# Altium schematic sheet AMP_filtreV2.SchDoc: Ampli
size A3; Author: Marius Fauteux; DrawnBy: Marius Fauteux; Engineer: Marius Fauteux; Organization: SynapsETS; Address1: ETS
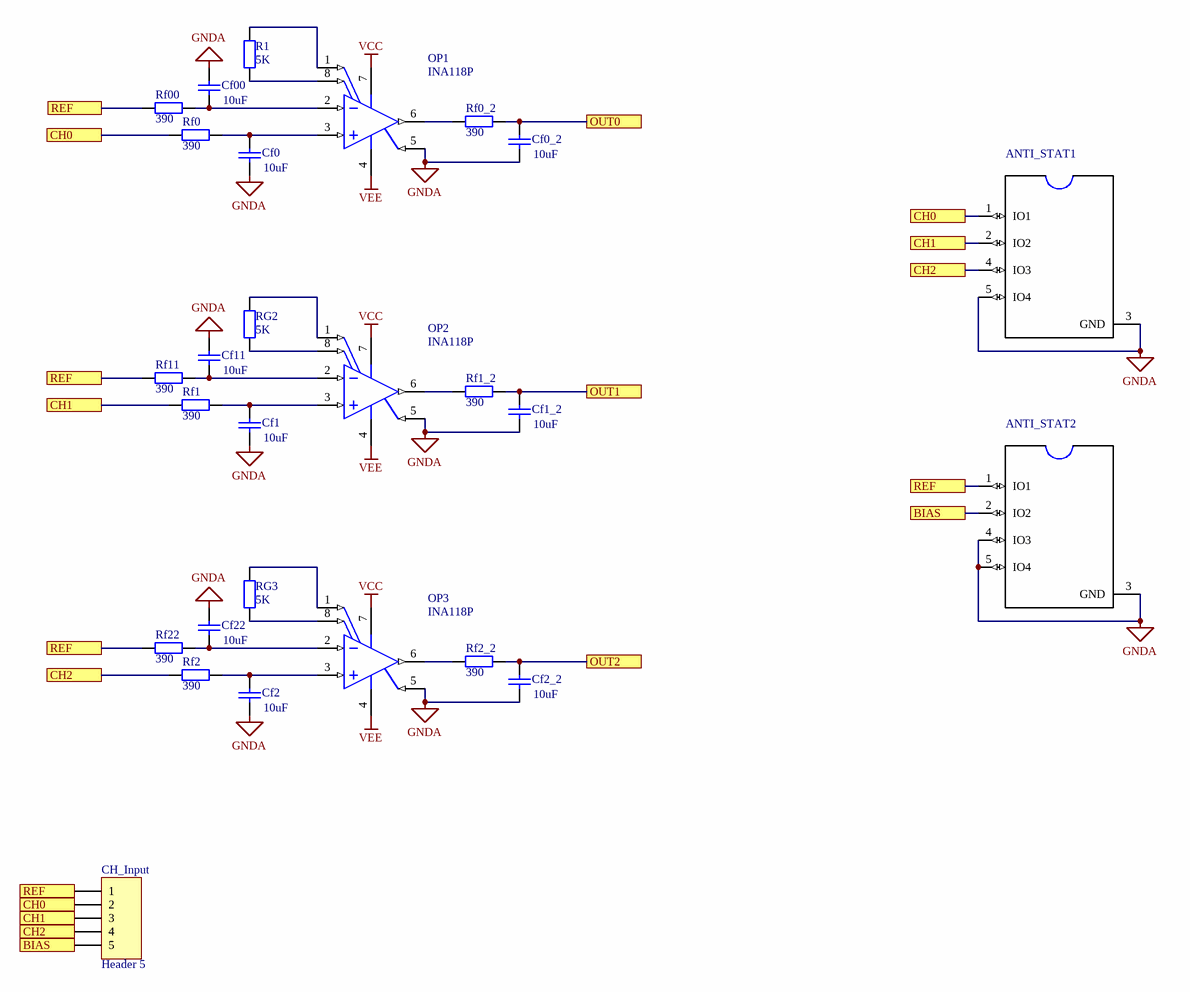
[diagram p0: AMP_filtreV2.SchDoc]

## Parts
ANTI_STAT1  TPD4E1B06DCKR  [SC70-6]  (value not drawn)
ANTI_STAT2  TPD4E1B06DCKR  [SC70-6]  (value not drawn)
Cf0  value 10uF  [1206 (3216 Metric)]  (hidden comment: C1206C106J8RACTU)
Cf00  value 10uF  [1206 (3216 Metric)]  (hidden comment: C1206C106J8RACTU)
Cf0_2  value 10uF  [1206 (3216 Metric)]  (hidden comment: C1206C106J8RACTU)
Cf1  value 10uF  [1206 (3216 Metric)]  (hidden comment: C1206C106J8RACTU)
Cf1_2  value 10uF  [1206 (3216 Metric)]  (hidden comment: C1206C106J8RACTU)
Cf2  value 10uF  [1206 (3216 Metric)]  (hidden comment: C1206C106J8RACTU)
Cf2_2  value 10uF  [1206 (3216 Metric)]  (hidden comment: C1206C106J8RACTU)
Cf11  value 10uF  [1206 (3216 Metric)]  (hidden comment: C1206C106J8RACTU)
Cf22  value 10uF  [1206 (3216 Metric)]  (hidden comment: C1206C106J8RACTU)
CH_Input  Header 5  [HDR1X5]
OP1  INA118P  [TI-P8]
OP2  INA118P  [TI-P8]
OP3  INA118P  [TI-P8]
R1  value 5K  [1206 (3216 Metric) RES]  (hidden comment: RT1206BRD075KL)
Rf0  value 390  [1206 (3216 Metric) RES]  (hidden comment: RC1206FR-07390RL)
Rf00  value 390  [1206 (3216 Metric) RES]  (hidden comment: RC1206FR-07390RL)
Rf0_2  value 390  [1206 (3216 Metric) RES]  (hidden comment: RC1206FR-07390RL)
Rf1  value 390  [1206 (3216 Metric) RES]  (hidden comment: RC1206FR-07390RL)
Rf1_2  value 390  [1206 (3216 Metric) RES]  (hidden comment: RC1206FR-07390RL)
Rf2  value 390  [1206 (3216 Metric) RES]  (hidden comment: RC1206FR-07390RL)
Rf2_2  value 390  [1206 (3216 Metric) RES]  (hidden comment: RC1206FR-07390RL)
Rf11  value 390  [1206 (3216 Metric) RES]  (hidden comment: RC1206FR-07390RL)
Rf22  value 390  [1206 (3216 Metric) RES]  (hidden comment: RC1206FR-07390RL)
RG2  value 5K  [1206 (3216 Metric) RES]  (hidden comment: RT1206BRD075KL)
RG3  value 5K  [1206 (3216 Metric) RES]  (hidden comment: RT1206BRD075KL)

## Ports
BIAS, CH0, CH1, CH2, OUT0, OUT1, OUT2, REF

## Nets
GNDA: ANTI_STAT1.3(GND) ANTI_STAT1.5(IO4) ANTI_STAT2.3(GND) ANTI_STAT2.4(IO3) ANTI_STAT2.5(IO4) Cf0.1 Cf00.2 Cf0_2.1 Cf1.1 Cf1_2.1 Cf2.1 Cf2_2.1 Cf11.2 Cf22.2 OP1.5(REF) OP2.5(REF) OP3.5(REF)
VCC: OP1.7(V+) OP2.7(V+) OP3.7(V+)
VEE: OP1.4(V-) OP2.4(V-) OP3.4(V-)
BIAS: ANTI_STAT2.2(IO2) CH_Input.5 ; port BIAS
CH0: ANTI_STAT1.1(IO1) CH_Input.2 Rf0.2 ; port CH0
CH1: ANTI_STAT1.2(IO2) CH_Input.3 Rf1.2 ; port CH1
CH2: ANTI_STAT1.4(IO3) CH_Input.4 Rf2.2 ; port CH2
OUT0: Cf0_2.2 Rf0_2.1 ; port OUT0
OUT1: Cf1_2.2 Rf1_2.1 ; port OUT1
OUT2: Cf2_2.2 Rf2_2.1 ; port OUT2
REF: ANTI_STAT2.1(IO1) CH_Input.1 Rf00.2 Rf11.2 Rf22.2 ; port REF
NetCf00_1: Cf00.1 OP1.2(VIN-) Rf00.1
NetCf0_2: Cf0.2 OP1.3(VIN+) Rf0.1
NetCf1_2: Cf1.2 OP2.3(VIN+) Rf1.1
NetCf2_2: Cf2.2 OP3.3(VIN+) Rf2.1
NetCf11_1: Cf11.1 OP2.2(VIN-) Rf11.1
NetCf22_1: Cf22.1 OP3.2(VIN-) Rf22.1
NetOP1_1: OP1.1(RG) R1.2
NetOP1_6: OP1.6(VO) Rf0_2.2
NetOP1_8: OP1.8(RG) R1.1
NetOP2_1: OP2.1(RG) RG2.2
NetOP2_6: OP2.6(VO) Rf1_2.2
NetOP2_8: OP2.8(RG) RG2.1
NetOP3_1: OP3.1(RG) RG3.2
NetOP3_6: OP3.6(VO) Rf2_2.2
NetOP3_8: OP3.8(RG) RG3.1

## Notes on the sheet
- Title
- Size:
- Date:
- A3
- Number:
- Time:
- Revision:
- Sheet
- of
- File:

## Library data of the parts
ANTI_STAT1 ANTI_STAT2 = TPD4E1B06DCKR: TVS DIODE 5.5VWM 14.5VC SC70-6; MF: Texas Instruments; Price: 0.29 USD; Package: SC-70 Texas Instruments; Availability: Good; MP: TPD4E1B06DCKR; Value: *
Cf0 Cf00 Cf0_2 Cf1 Cf1_2 Cf2 Cf2_2 Cf11 Cf22 = Cap: 10µF ±5% 10V Ceramic Capacitor X7R 1206 (3216 Metric); Published: 8-Jun-2000; LatestRevisionDate: 17-Jul-2002; LatestRevisionNote: Re-released for DXP Platform.; PackageReference: 1206 (3216 Metric); Publisher: Altium Limited; PackageDescription: CAP CER 10UF 10V X7R 1206
CH_Input = Header 5: Header, 5-Pin; LatestRevisionDate: 17-Jul-2002; LatestRevisionNote: Re-released for DXP Platform.; Publisher: Altium Limited
OP1-OP3 = INA118P: Precision, Low Power Instrumentation Amplifier, -40 to 85 degC, 8-pin DIP (P8), Green (RoHS & no Sb/Br); Manufacturer: Texas Instruments; CMRR(Min)(dB): 98; Gain(V/V): 1 to 10000; Input Bias Current (+/-)(Max)(nA): 10; Input Offset (+/-)(Max)(uV): 125; Input Offset Drift (+/-)(Max)(uV/Degrees Celsius): 1; Non-Linearity (+/-)(Max)(%): 0.004; Output Offset (+/-)(Max)(uV): 1000/G; Output Offset Drift (+/-)(Max)(uV/Degrees Celsius): 20/G; Quiescent Current (+/-)(Typ)(mA): 0.35; SubFamily: Single Supply; Vs(Max)(V): 36; Vs(Min)(V): 2.7; DatasheetVersion: SBOS027; PackageVersion: 4040082/E, 04/2010; PackageReference: P8; PackageDescription: 8-Pin Plastic In-Line, Body 9.59 x 6.35 mm, Pitch 2.54 mm; Supplier 1: Digi-Key; Supplier Part Number 1: INA118P-ND; Supplier 2: Newark; Supplier Part Number 2: 96K4515; Supplier 3: Mouser; Supplier Part Number 3: 595-INA118P; Eco-Plan: Green (RoHS & no Sb/Br); Noise at 1kHz(Typ)(nV/rt(Hz)): 10; Number of Channels: 1; Mounting Technology: Through Hole; Code_JEDEC: MS-001; PartNumber: INA118P; ComponentLink1Description: Manufacturer URL; ComponentLink1URL: http://www.ti.com/; ComponentLink2Description: Datasheet; ComponentLink2URL: http://www.ti.com/general/docs/lit/getliterature.tsp?genericPartNumber=INA118&fileType=pdf; ComponentLink3Description: Package Specification; ComponentLink3URL: http://www.ti.com/litv/pdf/mpdi001b
R1 RG2 RG3 = Res2: 5 kOhms ±0.1% 0.25W, 1/4W Chip Resistor 1206 (3216 Metric) Moisture Resistant Thin Film; Published: 8-Jun-2000; LatestRevisionDate: 17-Jul-2002; LatestRevisionNote: Re-released for DXP Platform.; PackageReference: 1206 (3216 Metric); Publisher: Altium Limited; PackageDescription: RES SMD 5K OHM 0.1% 1/4W 1206
Rf0 Rf00 Rf11 Rf22 = Res2: 390 Ohms ±1% 0.25W, 1/4W Chip Resistor 1206 (3216 Metric) Moisture Resistant Thick Film; Published: 8-Jun-2000; LatestRevisionDate: 17-Jul-2002; LatestRevisionNote: Re-released for DXP Platform.; PackageReference: 1206 (3216 Metric); Publisher: Altium Limited; PackageDescription: RES SMD 390 OHM 1% 1/4W 1206
Rf0_2 Rf1 Rf1_2 Rf2 Rf2_2 = Res2: Resistor; Published: 8-Jun-2000; LatestRevisionDate: 17-Jul-2002; LatestRevisionNote: Re-released for DXP Platform.; PackageReference: 1206 (3216 Metric); Publisher: Altium Limited; PackageDescription: RES SMD 390 OHM 1% 1/4W 1206